# EasyEDA Pro project XRAY.epro, schematic 倍压电路
Create Date: 2023-10-21; Page Name: P1; Project Name: X-RAY; Schematic Name: 倍压电路; Update Date: 2023-10-22; Company: 嘉立创EDA; Page Size: A4; Version: V1.0
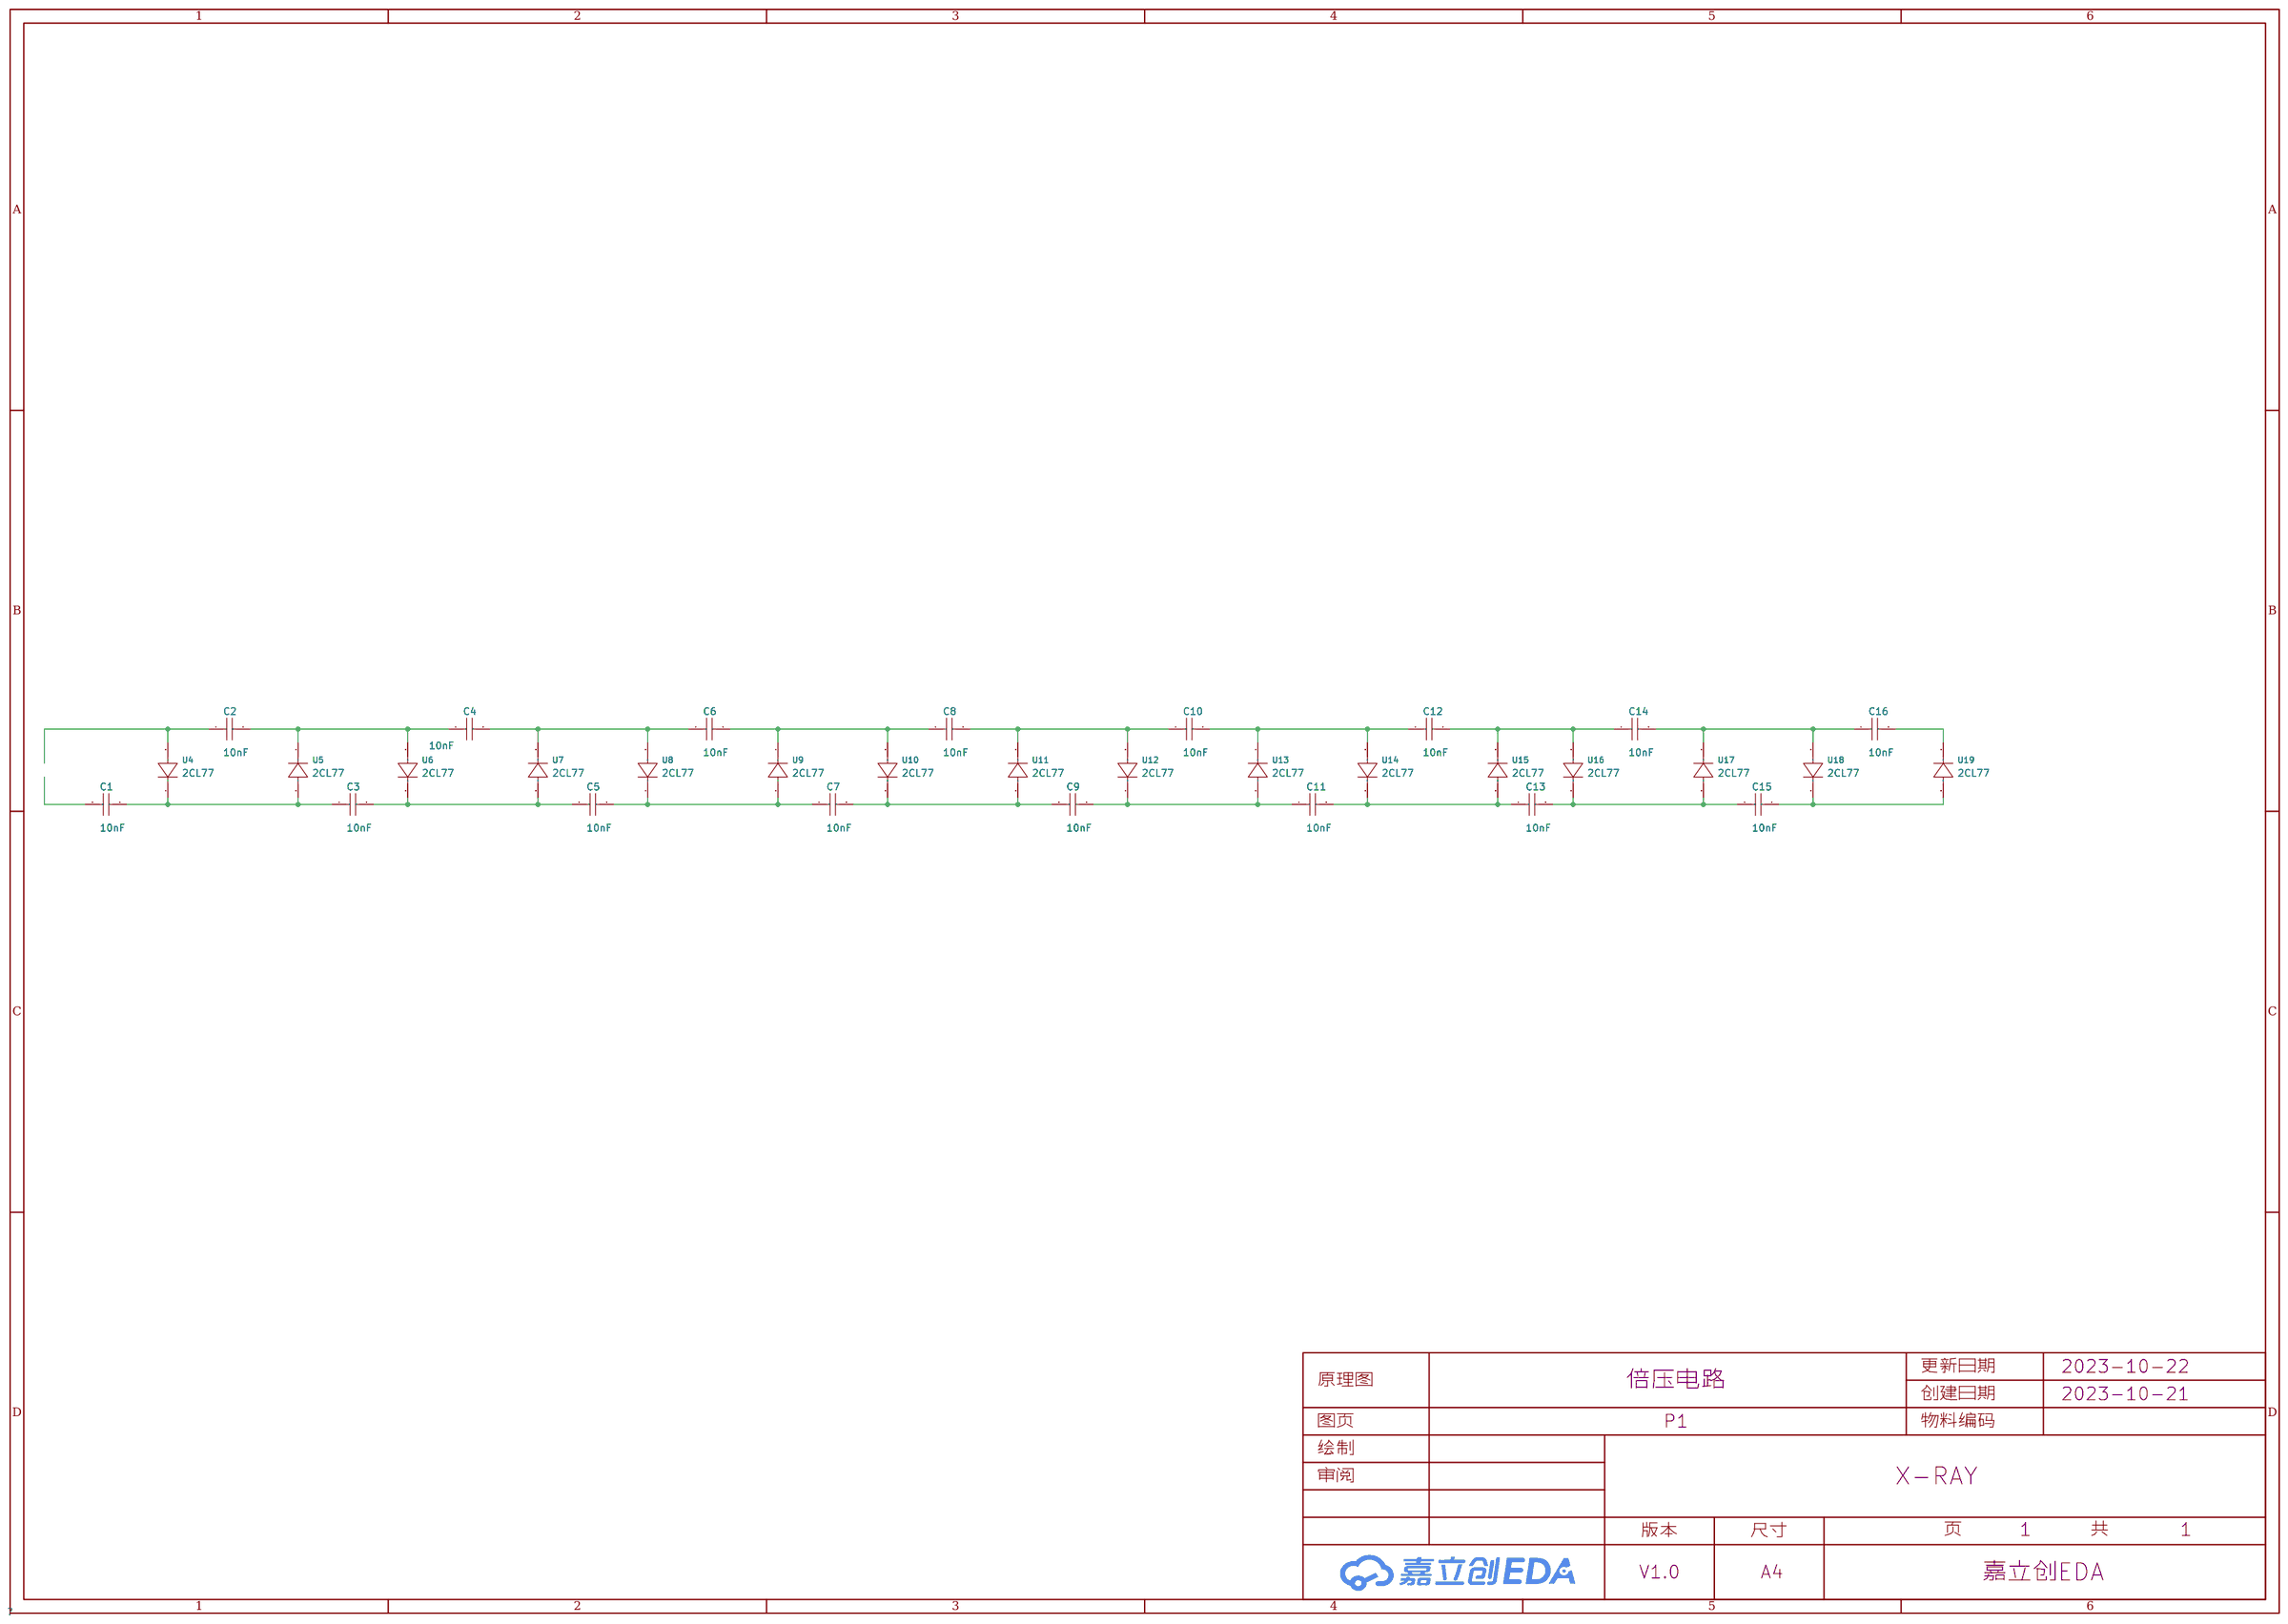
[diagram p2: schematic sheet]

## Parts
C1  10nF  [CAP-TH_L13.0-W3.5-P10.00-D1.0]
C2  10nF  [CAP-TH_L13.0-W3.5-P10.00-D1.0]
C3  10nF  [CAP-TH_L13.0-W3.5-P10.00-D1.0]
C4  10nF  [CAP-TH_L13.0-W3.5-P10.00-D1.0]
C5  10nF  [CAP-TH_L13.0-W3.5-P10.00-D1.0]
C6  10nF  [CAP-TH_L13.0-W3.5-P10.00-D1.0]
C7  10nF  [CAP-TH_L13.0-W3.5-P10.00-D1.0]
C8  10nF  [CAP-TH_L13.0-W3.5-P10.00-D1.0]
C9  10nF  [CAP-TH_L13.0-W3.5-P10.00-D1.0]
C10  10nF  [CAP-TH_L13.0-W3.5-P10.00-D1.0]
C11  10nF  [CAP-TH_L13.0-W3.5-P10.00-D1.0]
C12  10nF  [CAP-TH_L13.0-W3.5-P10.00-D1.0]
C13  10nF  [CAP-TH_L13.0-W3.5-P10.00-D1.0]
C14  10nF  [CAP-TH_L13.0-W3.5-P10.00-D1.0]
C15  10nF  [CAP-TH_L13.0-W3.5-P10.00-D1.0]
C16  10nF  [CAP-TH_L13.0-W3.5-P10.00-D1.0]
U4  2CL77  [DIO-TH_BD3.0-L12.0-P16.00-D0.6]
U5  2CL77  [DIO-TH_BD3.0-L12.0-P16.00-D0.6]
U6  2CL77  [DIO-TH_BD3.0-L12.0-P16.00-D0.6]
U7  2CL77  [DIO-TH_BD3.0-L12.0-P16.00-D0.6]
U8  2CL77  [DIO-TH_BD3.0-L12.0-P16.00-D0.6]
U9  2CL77  [DIO-TH_BD3.0-L12.0-P16.00-D0.6]
U10  2CL77  [DIO-TH_BD3.0-L12.0-P16.00-D0.6]
U11  2CL77  [DIO-TH_BD3.0-L12.0-P16.00-D0.6]
U12  2CL77  [DIO-TH_BD3.0-L12.0-P16.00-D0.6]
U13  2CL77  [DIO-TH_BD3.0-L12.0-P16.00-D0.6]
U14  2CL77  [DIO-TH_BD3.0-L12.0-P16.00-D0.6]
U15  2CL77  [DIO-TH_BD3.0-L12.0-P16.00-D0.6]
U16  2CL77  [DIO-TH_BD3.0-L12.0-P16.00-D0.6]
U17  2CL77  [DIO-TH_BD3.0-L12.0-P16.00-D0.6]
U18  2CL77  [DIO-TH_BD3.0-L12.0-P16.00-D0.6]
U19  2CL77  [DIO-TH_BD3.0-L12.0-P16.00-D0.6]

## Library data of the parts
C1-C16 = S14F1D103MN0B0S0N0: 容值:10nF;精度:±20%;额定电压:3kV;温度系数:Y5V;; LCSC Part Name: 10nF ±20% 3kV; Supplier Part: C249179; Manufacturer: STE(松田); Supplier Footprint: 插件,P=10mm; JLCPCB Part Class: Extended Part; Datasheet: https://atta.szlcsc.com/upload/public/pdf/source/20190806/C366874_7FA13009B587FE73099181E533DD7411.pdf; Supplier: LCSC; Tolerance: ±20%; Voltage Rated: 3kV; Lead Spacing: 10mm; Temperature Coefficient: Y5V; φD: 13mm; Body Thickness: 3.5mm
U4-U19 = 2CL77: 直流反向耐压(Vr):20kV;平均整流电流(Io):5mA;; LCSC Part Name: 20kV 5mA; Supplier Part: C424513; Manufacturer: SUNMATE(森美特); Supplier Footprint: 插件,D3xL12mm; Datasheet: https://atta.szlcsc.com/upload/public/pdf/source/20220617/7024E2F52CE4C6745875D4ADB64BCCE6.pdf; Supplier: LCSC; Reverse Voltage (Vr): 20kV; Average Rectified Current (Io): 5mA; Reverse Leakage Current: 2uA

## Nets
$1N855: C2.2 C4.1 U5.1(K) U6.2(A)
$1N856: C1.2 C3.1 U4.1(K) U5.2(A)
$1N857: C4.2 C6.1 U7.1(K) U8.2(A)
$1N858: C3.2 C5.1 U6.1(K) U7.2(A)
$1N859: C6.2 C8.1 U9.1(K) U10.2(A)
$1N860: C5.2 C7.1 U8.1(K) U9.2(A)
$1N861: C8.2 C10.1 U11.1(K) U12.2(A)
$1N862: C7.2 C9.1 U10.1(K) U11.2(A)
$1N863: C10.2 C12.1 U13.1(K) U14.2(A)
$1N864: C9.2 C11.1 U12.1(K) U13.2(A)
$1N865: C2.1 U4.2(A)
$1N1482: C11.2 C13.1 U14.1(K) U15.2(A)
$1N3211: C12.2 C14.1 U15.1(K) U16.2(A)
$1N3212: C14.2 C16.1 U17.1(K) U18.2(A)
$1N3213: C13.2 C15.1 U16.1(K) U17.2(A)
$1N3214: C16.2 U19.1(K)
$1N3215: C15.2 U18.1(K) U19.2(A)

Not connected (* = marked no-connect by the designer): C1 1
